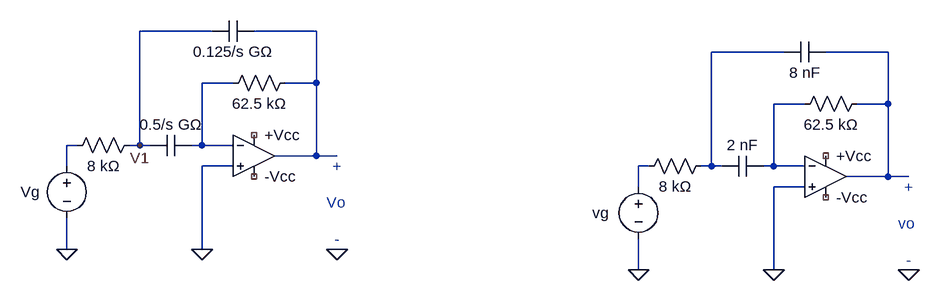
[diagram p0: schematic pre3.asc]
pre3.asc, the LTspice schematic file:
Version 4.1
SHEET 1 1188 680
WIRE 96 0 -16 0
WIRE 256 0 160 0
WIRE 976 32 864 32
WIRE 1136 32 1040 32
WIRE 128 80 80 80
WIRE 256 80 256 0
WIRE 256 80 208 80
WIRE 1008 112 960 112
WIRE 1136 112 1136 32
WIRE 1136 112 1088 112
WIRE -112 176 -128 176
WIRE -16 176 -16 0
WIRE -16 176 -32 176
WIRE 0 176 -16 176
WIRE 80 176 80 80
WIRE 80 176 64 176
WIRE 128 176 80 176
WIRE 256 192 256 80
WIRE 256 192 192 192
WIRE 288 192 256 192
WIRE -128 208 -128 176
WIRE 128 208 80 208
WIRE 768 208 752 208
WIRE 864 208 864 32
WIRE 864 208 848 208
WIRE 880 208 864 208
WIRE 960 208 960 112
WIRE 960 208 944 208
WIRE 1008 208 960 208
WIRE 1136 224 1136 112
WIRE 1136 224 1072 224
WIRE 1168 224 1136 224
WIRE 752 240 752 208
WIRE 1008 240 960 240
WIRE -128 336 -128 288
WIRE 80 336 80 208
WIRE 752 368 752 320
WIRE 960 368 960 240
FLAG -128 336 0
FLAG 80 336 0
FLAG 288 336 0
FLAG -16 176 V1
FLAG 752 368 0
FLAG 960 368 0
FLAG 1168 368 0
SYMBOL voltage -128 192 R0
WINDOW 0 -71 56 Left 2
WINDOW 3 24 96 Invisible 2
SYMATTR InstName Vg
SYMBOL OpAmps\\opamp2 160 128 R0
SYMATTR InstName +Vcc
SYMATTR Value -Vcc
SYMBOL cap 160 -16 R90
WINDOW 0 0 32 Invisible 2
WINDOW 3 32 32 VTop 2
SYMATTR InstName C1
SYMATTR Value 0.125/s GΩ
SYMBOL cap 0 192 R270
WINDOW 0 32 32 Invisible 2
WINDOW 3 64 32 VBottom 2
SYMATTR InstName C2
SYMATTR Value 0.5/s GΩ
SYMBOL res -16 160 R90
WINDOW 0 0 56 Invisible 2
WINDOW 3 32 56 VTop 2
SYMATTR InstName R1
SYMATTR Value 8 kΩ
SYMBOL res 224 64 R90
WINDOW 0 0 56 Invisible 2
WINDOW 3 32 56 VTop 2
SYMATTR InstName R2
SYMATTR Value 62.5 kΩ
SYMBOL voltage 752 224 R0
WINDOW 0 -71 56 Left 2
WINDOW 3 24 96 Invisible 2
SYMATTR InstName vg
SYMBOL OpAmps\\opamp2 1040 160 R0
SYMATTR InstName +Vcc
SYMATTR Value -Vcc
SYMBOL cap 1040 16 R90
WINDOW 0 0 32 Invisible 2
WINDOW 3 32 32 VTop 2
SYMATTR InstName C3
SYMATTR Value 8 nF
SYMBOL cap 880 224 R270
WINDOW 0 32 32 Invisible 2
WINDOW 3 64 32 VBottom 2
SYMATTR InstName C4
SYMATTR Value 2 nF
SYMBOL res 864 192 R90
WINDOW 0 0 56 Invisible 2
WINDOW 3 32 56 VTop 2
SYMATTR InstName R3
SYMATTR Value 8 kΩ
SYMBOL res 1104 96 R90
WINDOW 0 0 56 Invisible 2
WINDOW 3 32 56 VTop 2
SYMATTR InstName R4
SYMATTR Value 62.5 kΩ
TEXT 272 264 Left 2 ;Vo
TEXT 288 208 Center 2 ;+
TEXT 288 320 Center 2 ;-
TEXT 1152 296 Left 2 ;vo
TEXT 1168 240 Center 2 ;+
TEXT 1168 352 Center 2 ;-

The netlist it stands for:
* pre3.asc
Vg N006 0 V
X§+Vcc 0 N004 NC_01 NC_02 N001 -Vcc  ; pins In+ In- V+ V- OUT
C1 N001 V1 0.125/s GΩ
C2 V1 N004 0.5/s GΩ
R1 V1 N006 8 kΩ
R2 N001 N004 62.5 kΩ
vg N007 0 V
X§+Vcc 0 N005 NC_03 NC_04 N003 -Vcc  ; pins In+ In- V+ V- OUT
C3 N003 N002 8 nF
C4 N002 N005 2 nF
R3 N002 N007 8 kΩ
R4 N003 N005 62.5 kΩ
* Vo
* +
* -
* vo
* +
* -
.backanno
.end